# Altium schematic sheet C64_ITFC_X .SchDoc
size B; SheetNumber: 2; SheetTotal: 3
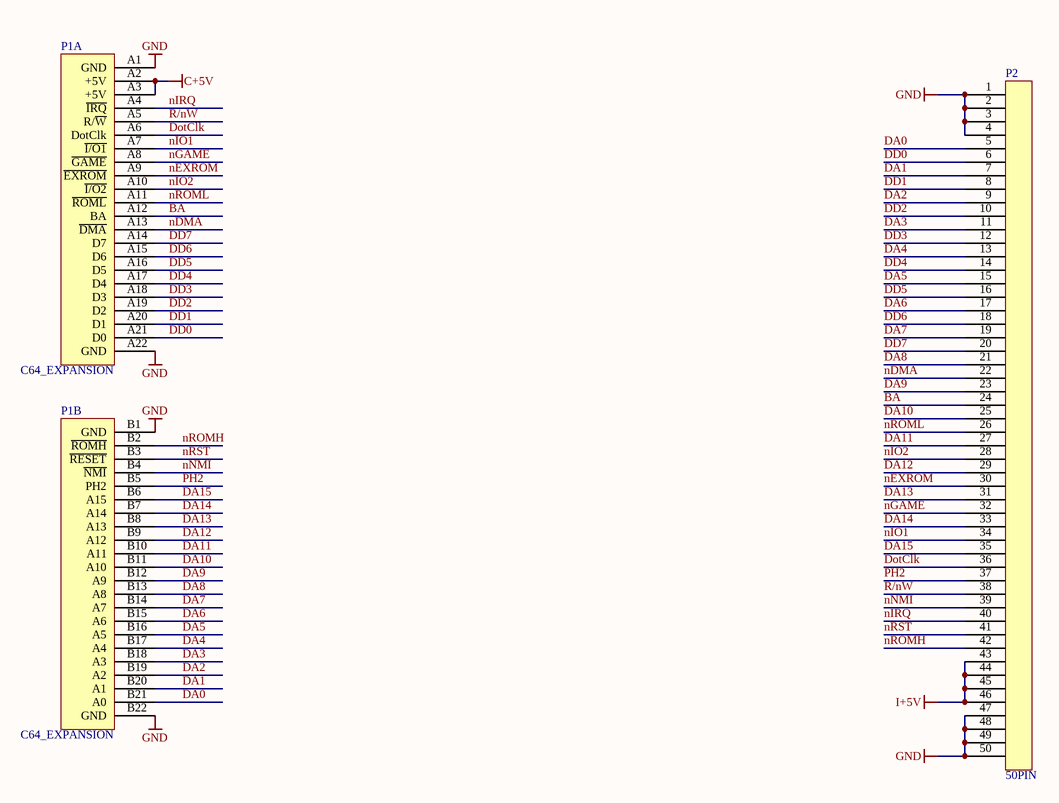
[diagram p0: C64_ITFC_X .SchDoc]

## Parts
P1  C64_EXPANSION  [C64_EXPANSION]  (parts A,B of 2)
P2  50PIN  [IDC50_40]

## Nets
C+5V: P1.A2(+5V) P1.A3(+5V)
GND: P1.A1(GND) P1.A22(GND) P1.B1(GND) P1.B22(GND) P2.1 P2.2 P2.3 P2.4 P2.47 P2.48 P2.49 P2.50
I+5V: P2.43 P2.44 P2.45 P2.46
BA: P1.A12(BA) P2.24
DA0: P1.B21(A0) P2.5
DA1: P1.B20(A1) P2.7
DA2: P1.B19(A2) P2.9
DA3: P1.B18(A3) P2.11
DA4: P1.B17(A4) P2.13
DA5: P1.B16(A5) P2.15
DA6: P1.B15(A6) P2.17
DA7: P1.B14(A7) P2.19
DA8: P1.B13(A8) P2.21
DA9: P1.B12(A9) P2.23
DA10: P1.B11(A10) P2.25
DA11: P1.B10(A11) P2.27
DA12: P1.B9(A12) P2.29
DA13: P1.B8(A13) P2.31
DA14: P1.B7(A14) P2.33
DA15: P1.B6(A15) P2.35
DD0: P1.A21(D0) P2.6
DD1: P1.A20(D1) P2.8
DD2: P1.A19(D2) P2.10
DD3: P1.A18(D3) P2.12
DD4: P1.A17(D4) P2.14
DD5: P1.A16(D5) P2.16
DD6: P1.A15(D6) P2.18
DD7: P1.A14(D7) P2.20
DotClk: P1.A6(DotClk) P2.36
nDMA: P1.A13(~{DMA}) P2.22
nEXROM: P1.A9(~{EXROM}) P2.30
nGAME: P1.A8(~{GAME}) P2.32
nIO1: P1.A7(~{I/O1}) P2.34
nIO2: P1.A10(~{I/O2}) P2.28
nIRQ: P1.A4(~{IRQ}) P2.40
nNMI: P1.B4(~{NMI}) P2.39
nROMH: P1.B2(~{ROMH}) P2.42
nROML: P1.A11(~{ROML}) P2.26
nRST: P1.B3(~{RESET}) P2.41
PH2: P1.B5(PH2) P2.37
R/nW: P1.A5(R/~{W}) P2.38

## Library data of the parts
P1 = C64_EXPANSION: C64 Expansion Connector